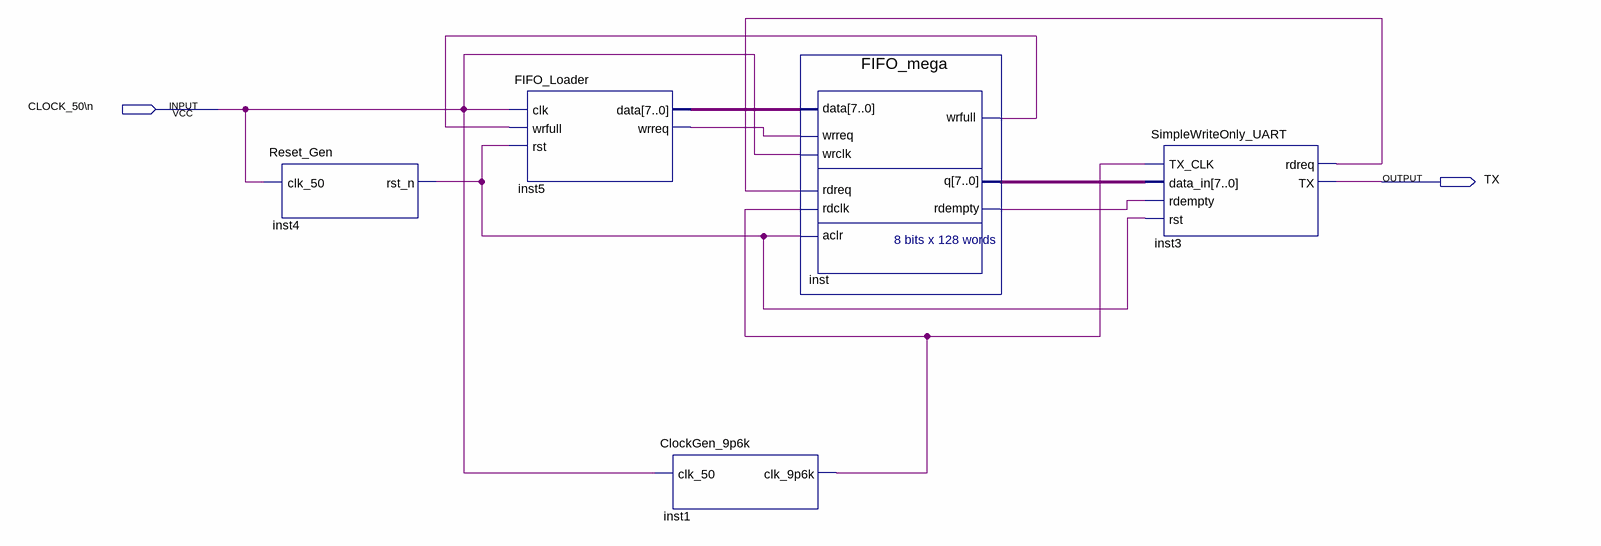
[diagram p0: schematic sheet]
// Quartus schematic FIFOTest_top.bdf as structural Verilog: 5 symbols, 2 pins
module FIFOTest_top (
  input  \CLOCK_50\n ,
  output TX
);

  wire inst1_clk_9p6k, inst3_rdreq, inst4_rst_n, inst5_wrreq, inst_rdempty, inst_wrfull;
  wire [7:0] inst5_data, inst_q;

  Reset_Gen inst4 (.clk_50(\CLOCK_50\n ), .rst_n(inst4_rst_n));
  FIFO_Loader inst5 (
    .clk(\CLOCK_50\n ), .wrfull(inst_wrfull), .rst(inst4_rst_n), .data(inst5_data), .wrreq(inst5_wrreq));
  ClockGen_9p6k inst1 (.clk_50(\CLOCK_50\n ), .clk_9p6k(inst1_clk_9p6k));
  FIFO_mega inst (
    .data(inst5_data), .wrreq(inst5_wrreq), .wrclk(\CLOCK_50\n ), .rdreq(inst3_rdreq),
    .rdclk(inst1_clk_9p6k), .aclr(inst4_rst_n), .wrfull(inst_wrfull), .q(inst_q), .rdempty(inst_rdempty));
  SimpleWriteOnly_UART inst3 (
    .TX_CLK(inst1_clk_9p6k), .data_in(inst_q), .rdempty(inst_rdempty), .rst(inst4_rst_n),
    .rdreq(inst3_rdreq), .TX(TX));
endmodule
